# Altium project SmartSequins9.1.PrjPcb
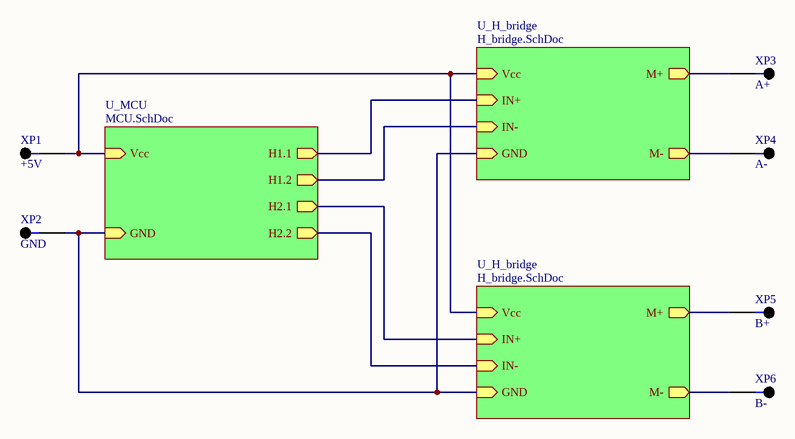
[diagram p0: SmartSequins9.1.SchDoc]
3 sheets, 46 parts. Net scope: hierarchical (ports join the sheet entries above them; power ports are global).
Board files: SmartSequins9.1.PcbDoc, SmartSequins9.1.2.PcbDoc
Sheets:
  SmartSequins9.1.SchDoc
    U_MCU = MCU.SchDoc
    U_H_bridge = H_bridge.SchDoc
    U_H_bridge = H_bridge.SchDoc

## Sheet SmartSequins9.1.SchDoc
size A4

### Parts
XP1  +5V  [XP_solder]
XP2  GND  [XP_solder]
XP3  A+  [XP_solder]
XP4  A-  [XP_solder]
XP5  B+  [XP_solder]
XP6  B-  [XP_solder]

### Sub-sheets
U_H_bridge = H_bridge.SchDoc: IN+ (in), IN- (in), Vcc (in), M+ (out), M- (out), GND (in)
U_H_bridge = H_bridge.SchDoc: IN+ (in), IN- (in), Vcc (in), M+ (out), M- (out), GND (in)
U_MCU = MCU.SchDoc: Vcc (in), GND (in), H1.1 (out), H1.2 (out), H2.1 (out), H2.2 (out)

### Nets
GND_B: XP2.1 ; sheet U_MCU/GND, sheet U_H_bridge/GND, sheet U_H_bridge/GND
MCU_VCC: XP1.1 ; sheet U_MCU/Vcc, sheet U_H_bridge/Vcc, sheet U_H_bridge/Vcc
NetDD1_1: sheet U_MCU/H2.1, sheet U_H_bridge/IN+
NetDD1_2: sheet U_MCU/H2.2, sheet U_H_bridge/IN-
NetDD1_5: sheet U_MCU/H1.1, sheet U_H_bridge/IN+
NetDD1_7: sheet U_MCU/H1.2, sheet U_H_bridge/IN-
NetR5_1: XP5.1 ; sheet U_H_bridge/M+
NetR10_1: XP3.1 ; sheet U_H_bridge/M+
NetVD3_1: XP6.1 ; sheet U_H_bridge/M-
NetVD7_1: XP4.1 ; sheet U_H_bridge/M-

### Library data of the parts
XP1-XP6 = XP_solder

## Sheet MCU.SchDoc
size A4
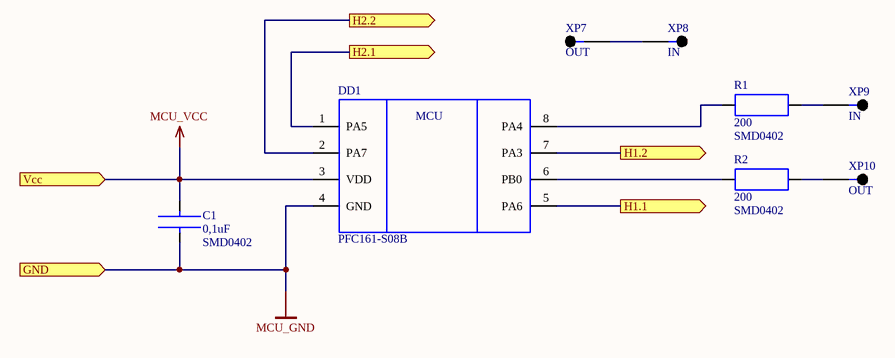
[diagram p1: MCU.SchDoc]

### Parts
C1  0,1uF  Package: SMD0402  [SMD0402(1608)]
DD1  PFC161-S08B  [SOIC8]
R1  200  Package: SMD0402  [SMD0402(1608)]
R2  200  Package: SMD0402  [SMD0402(1608)]
XP7  OUT  [XP_solder]
XP8  IN  [XP_solder]
XP9  IN  [XP_solder]
XP10  OUT  [XP_solder]

### Ports
GND (in), H1.1 (out), H1.2 (out), H2.1 (out), H2.2 (out), Vcc (in)

### Nets
MCU_GND: C1.2 DD1.4(GND) ; port GND  [project net GND_B]
MCU_VCC: C1.1 DD1.3(VDD) ; port Vcc
NetDD1_1: DD1.1(PA5) ; port H2.1
NetDD1_2: DD1.2(PA7) ; port H2.2
NetDD1_5: DD1.5(PA6) ; port H1.1
NetDD1_6: DD1.6(PB0) R2.1
NetDD1_7: DD1.7(PA3) ; port H1.2
NetDD1_8: DD1.8(PA4) R1.1
NetR1_2: R1.2 XP9.1
NetR2_2: R2.2 XP10.1
NetXP7_1: XP7.1 XP8.1

### Notes on the sheet
- (in symbol PFC161-S08B) MCU

### Library data of the parts
C1 = CER_CUP_0402: Type: C; ValueBOM: Конденсатор керамический 0,1мкФ х 50В SMD 0402 1%; Value: 0,1uF
DD1 = PFC161-S08B: ValueBOM: Микроконтроллер PFC161-S08B, SOIC-8; Type: DD; Value: PFC161-S08B; Package: SOIC-8
R1 R2 = R_0402: ValueBOM: Резистор 200Ом SMD 0402 1%; Type: R; Value: 200
XP7-XP10 = XP_solder

## Sheet H_bridge.SchDoc
size A4
Used 2 times, as channels U_H_bridge, U_H_bridge. Parts and nets are listed once, with the designators drawn on the sheet.
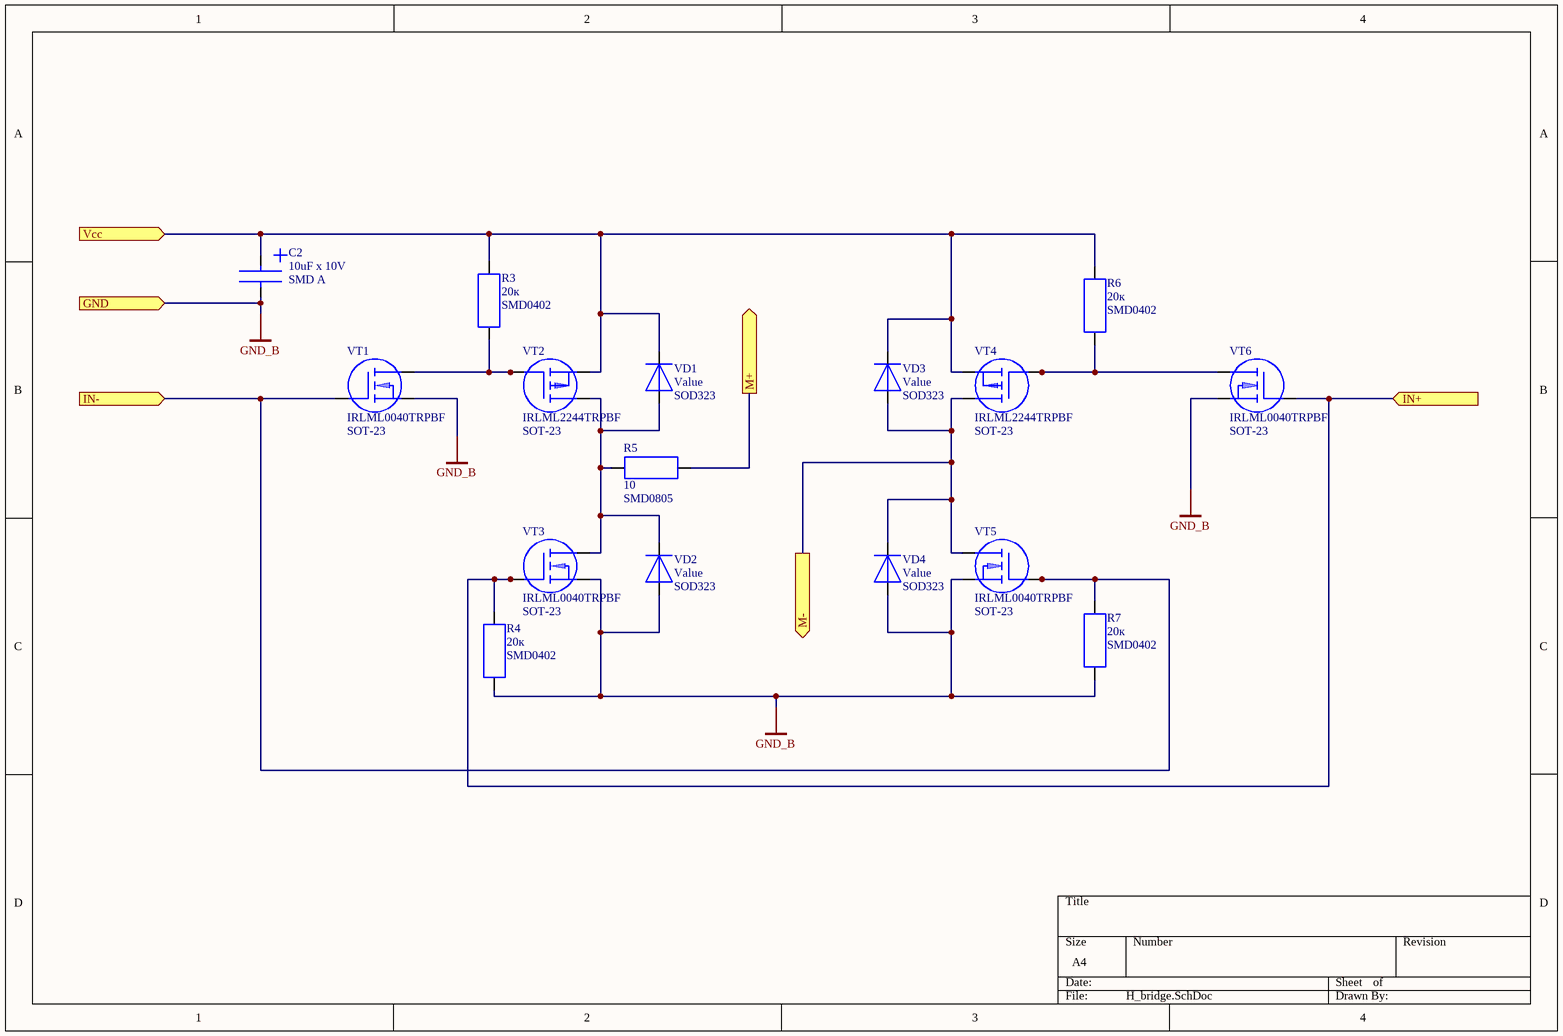
[diagram p2: H_bridge.SchDoc]

### Parts
C2  10uF x 10V  Package: SMD A  [TANT_CAP_A(3216)]
R3  20к  Package: SMD0402  [SMD0402(1608)]
R4  20к  Package: SMD0402  [SMD0402(1608)]
R5  10  Package: SMD0805  [SMD0805(2012)]
R6  20к  Package: SMD0402  [SMD0402(1608)]
R7  20к  Package: SMD0402  [SMD0402(1608)]
VD1  Value  [SOD323]
VD2  Value  [SOD323]
VD3  Value  [SOD323]
VD4  Value  [SOD323]
VT1  IRLML0040TRPBF  Package: SOT-23  [SOT23-3]
VT2  IRLML2244TRPBF  Package: SOT-23  [SOT23-3]
VT3  IRLML0040TRPBF  Package: SOT-23  [SOT23-3]
VT4  IRLML2244TRPBF  Package: SOT-23  [SOT23-3]
VT5  IRLML0040TRPBF  Package: SOT-23  [SOT23-3]
VT6  IRLML0040TRPBF  Package: SOT-23  [SOT23-3]

### Ports
GND (in), IN+ (in), IN- (in), M+ (out), M- (out), Vcc (in)

### Nets
GND_B: C2.2 R4.2 R7.2 VD2.1 VD4.1 VT1.2 VT3.2 VT5.2 VT6.2 ; port GND
IN+: R4.1 VT3.1 VT6.1 ; port IN+
IN-: R7.1 VT1.1 VT5.1 ; port IN-
M+: R5.1 ; port M+
M-: VD3.1 VD4.2 VT4.3 VT5.3 ; port M-
Vcc: C2.1 R3.1 R6.1 VD1.2 VD3.2 VT2.2 VT4.2 ; port Vcc
NetR3_2: R3.2 VT1.3 VT2.1
NetR5_2: R5.2 VD1.1 VD2.2 VT2.3 VT3.3
NetR6_2: R6.2 VT4.1 VT6.3

### Channels
U_H_bridge: designators C2=C3 R3=R8 R4=R9 R5=R10 R6=R11 R7=R12 VD1=VD5 VD2=VD6 VD3=VD7 VD4=VD8 VT1=VT7 VT2=VT8 VT3=VT9 VT4=VT10 VT5=VT11 VT6=VT12; ports GND=GND_B IN+=NetDD1_5 IN-=NetDD1_7 M+=NetR10_1 M-=NetVD7_1 Vcc=MCU_VCC
U_H_bridge: ports GND=GND_B IN+=NetDD1_1 IN-=NetDD1_2 M+=NetR5_1 M-=NetVD3_1 Vcc=MCU_VCC

### Library data of the parts
C2 = C_TANT_A: Type: C; ValueBOM: Конденсатор танталовый 10мкФ х 10В SMD A; Value: 10uF x 10V
R3 R4 R6 R7 = R_0402: ValueBOM: Резистор 20кОм SMD 0402 1%; Type: R; Value: 20к
R5 = R_0805: ValueBOM: Резистор 10 Ом SMD 0805 1%; Type: R; Value: 10
VD1-VD4 = DIODE_SOD323: Type: VD; ValueBOM: Диод Шоттки SOD323; Value: Value; Package: SOD323
VT1 VT3 VT5 VT6 = VT_N_MOSFET_SOT23_3: Type: VT; ValueBOM: Транзистор n-МОП IRLML0040TRPBF SOT23; Value: IRLML0040TRPBF
VT2 VT4 = VT_P_MOSFET_SOT23_3: Type: VT; ValueBOM: Транзистор p-МОП IRLML2244TRPBF SOT23; Value: IRLML2244TRPBF

## Nets that join several sheets
GND_B: SmartSequins9.1 (XP2.1), MCU (C1.2 DD1.4), U_H_bridge (9 pins), U_H_bridge (9 pins)
MCU_VCC: SmartSequins9.1 (XP1.1), MCU (C1.1 DD1.3), U_H_bridge (7 pins), U_H_bridge (7 pins)
NetDD1_1: MCU (DD1.1), U_H_bridge (R4.1 VT3.1 VT6.1)
NetDD1_2: MCU (DD1.2), U_H_bridge (R7.1 VT1.1 VT5.1)
NetDD1_5: MCU (DD1.5), U_H_bridge (R9.1 VT9.1 VT12.1)
NetDD1_7: MCU (DD1.7), U_H_bridge (R12.1 VT7.1 VT11.1)
NetR5_1: SmartSequins9.1 (XP5.1), U_H_bridge (R5.1)
NetR10_1: SmartSequins9.1 (XP3.1), U_H_bridge (R10.1)
NetVD3_1: SmartSequins9.1 (XP6.1), U_H_bridge (VD3.1 VD4.2 VT4.3 VT5.3)
NetVD7_1: SmartSequins9.1 (XP4.1), U_H_bridge (VD7.1 VD8.2 VT10.3 VT11.3)